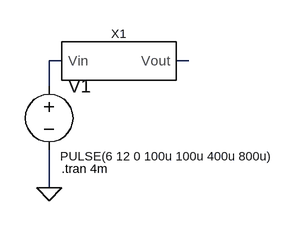
[diagram p0: schematic SUBCKT Hierarchy Zener Voltage Regulator.asc]
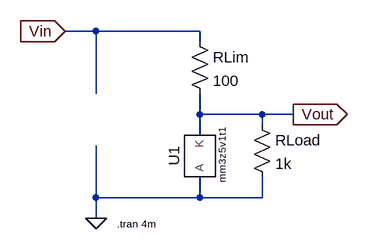
[diagram p1: sub-circuit hierarchyzenervoltageregulator.asc]
SUBCKT Hierarchy Zener Voltage Regulator.asc, the LTspice schematic file:
Version 4
SHEET 1 924 788
WIRE 0 32 -16 32
WIRE 160 32 144 32
WIRE -16 64 -16 32
WIRE -16 192 -16 144
FLAG -16 192 0
SYMBOL voltage -16 48 R0
WINDOW 123 0 0 Left 0
WINDOW 39 0 0 Left 0
WINDOW 3 14 104 Left 1
SYMATTR Value PULSE(6 12 0 100u 100u 400u 800u)
SYMATTR InstName V1
SYMBOL HierarchyZenerVoltageRegulator 64 32 R0
SYMATTR InstName X1
TEXT 0 168 Left 1 !.tran 4m

hierarchyzenervoltageregulator.asc, the sub-circuit schematic file:
Version 4
SHEET 1 924 788
WIRE -16 32 -64 32
WIRE 144 32 -16 32
WIRE 144 48 144 32
WIRE -16 128 -16 32
WIRE 144 160 144 128
WIRE 240 160 144 160
WIRE 288 160 240 160
WIRE 240 176 240 160
WIRE 144 192 144 160
WIRE -16 288 -16 208
WIRE 144 288 144 256
WIRE 144 288 -16 288
WIRE 240 288 240 256
WIRE 240 288 144 288
WIRE -16 320 -16 288
FLAG -16 320 0
FLAG -64 32 Vin
IOPIN -64 32 In
FLAG 288 160 Vout
IOPIN 288 160 Out
SYMBOL res 128 32 R0
SYMATTR InstName RLim
SYMATTR Value 100
SYMBOL res 224 160 R0
SYMATTR InstName RLoad
SYMATTR Value 1k
SYMBOL mm3z5v1t1 144 224 R270
WINDOW 3 0 24 Top 1
SYMATTR InstName U1
TEXT 16 328 Left 1 !.tran 4m

The netlist it stands for:
* SUBCKT Hierarchy Zener Voltage Regulator.asc
V1 N001 0 PULSE(6 12 0 100u 100u 400u 800u)
XX1 N001 N002 hierarchyzenervoltageregulator

* block symbol definitions
.subckt hierarchyzenervoltageregulator Vin Vout
RLim Vin Vout 100
RLoad Vout 0 1k
XU1 0 Vout mm3z5v1t1  ; pins A K
.tran 4m
.ends hierarchyzenervoltageregulator

.tran 4m
.lib MM3Z5V1LT1.LIB
.backanno
.end